# Altium schematic sheet RS485.SchDoc
size A4; SheetNumber: 7; SheetTotal: 8
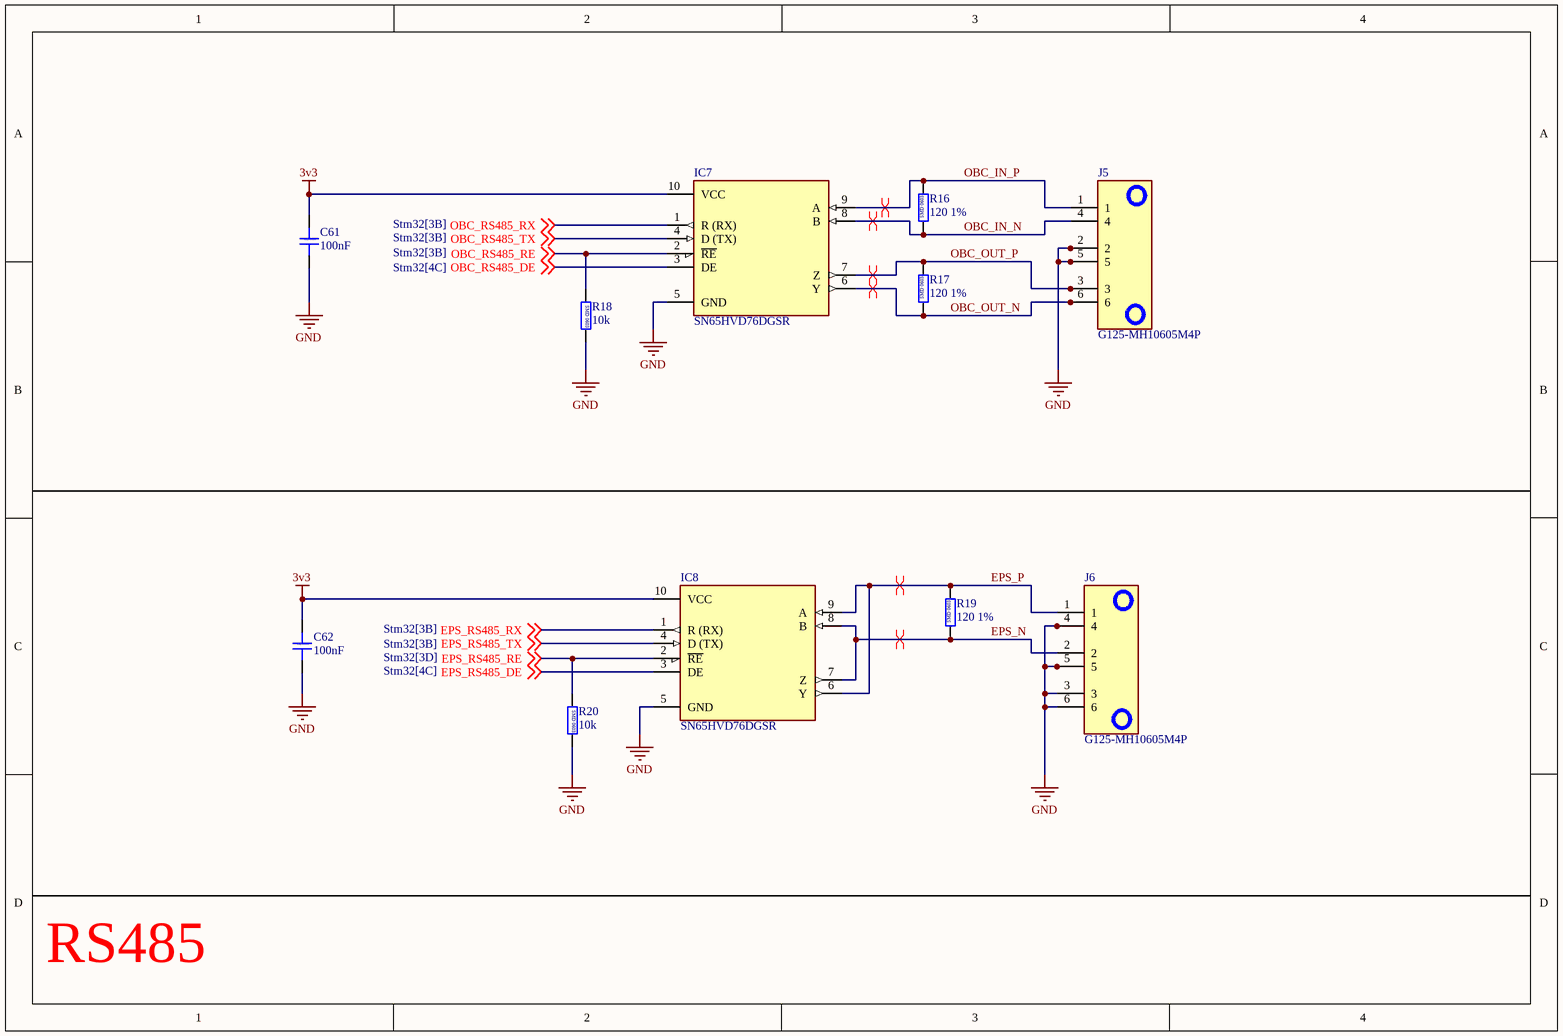
[diagram p0: RS485.SchDoc]

## Parts
C61  100nF  [CAP_0603]
C62  100nF  [CAP_0603]
IC7  SN65HVD76DGSR  [SOP50P490X110-10N]
IC8  SN65HVD76DGSR  [SOP50P490X110-10N]
J5  G125-MH10605M4P  [G125-MH10605M4P_1]
J6  G125-MH10605M4P  [G125-MH10605M4P_1]
R16  120 1%  [RES_0603]
R17  120 1%  [RES_0603]
R18  10k  [RES_0603]
R19  120 1%  [RES_0603]
R20  10k  [RES_0603]

## Nets
3v3: C61.1 C62.1 IC7.10(VCC) IC8.10(VCC)
GND: C61.2 C62.2 IC7.5(GND) IC8.5(GND) J5.2 J5.5 J6.3 J6.4 J6.5 J6.6 R18.2 R20.2
EPS_N: IC8.7(Z) IC8.8(B) J6.2 R19.1
EPS_P: IC8.6(Y) IC8.9(A) J6.1 R19.2
EPS_RS485_DE: IC8.3(DE) ; off-sheet EPS_RS485_DE
EPS_RS485_RE: IC8.2(~{RE}) R20.1 ; off-sheet EPS_RS485_RE
EPS_RS485_RX: IC8.1(R_(RX)) ; off-sheet EPS_RS485_RX
EPS_RS485_TX: IC8.4(D_(TX)) ; off-sheet EPS_RS485_TX
OBC_IN_N: IC7.8(B) J5.4 R16.1
OBC_IN_P: IC7.9(A) J5.1 R16.2
OBC_OUT_N: IC7.6(Y) J5.6 R17.1
OBC_OUT_P: IC7.7(Z) J5.3 R17.2
OBC_RS485_DE: IC7.3(DE) ; off-sheet OBC_RS485_DE
OBC_RS485_RE: IC7.2(~{RE}) R18.1 ; off-sheet OBC_RS485_RE
OBC_RS485_RX: IC7.1(R_(RX)) ; off-sheet OBC_RS485_RX
OBC_RS485_TX: IC7.4(D_(TX)) ; off-sheet OBC_RS485_TX

## Layout directives
differential pair: EPS_N, EPS_P, OBC_IN_N, OBC_IN_P, OBC_OUT_N, OBC_OUT_P

## Notes on the sheet
- RS485
- (in symbol Capacitor-SMD-0603) SMD 0603
- (in symbol Resistor-SMD-0603) SMD 0603

## Library data of the parts
C61 C62 = Capacitor-SMD-0603: Capacitor SMD 0603 RATED
IC7 IC8 = SN65HVD76DGSR: RS485 Full Duplex Transciever; Manufacturer_Name: Texas Instruments; Datasheet Link: http://www.ti.com/lit/gpn/sn65hvd76; Height: 1.1mm; Manufacturer_Part_Number: SN65HVD76DGSR; Mouser Part Number: 595-SN65HVD76DGSR; Mouser Price/Stock: https://www.mouser.co.uk/ProductDetail/Texas-Instruments/SN65HVD76DGSR?qs=7z%252BmIopC6%2FI%252B8LLIzcebYw%3D%3D; Arrow Part Number: SN65HVD76DGSR; Arrow Price/Stock: https://www.arrow.com/en/products/sn65hvd76dgsr/texas-instruments?region=nac
J5 J6 = G125-MH10605M4P: Connector; Manufacturer_Name: Harwin; Datasheet Link: https://content.harwin.com/m/667f1be9427fb768/original/DRG-02921-Technical-Drawing-Datasheet-G125-MH1XX05M4P-pdf.pdf; Height: 5.3mm; Manufacturer_Part_Number: G125-MH10605M4P; Mouser Part Number: 855-G125MH1065M4PM4P; Mouser Price/Stock: https://www.mouser.co.uk/ProductDetail/Harwin/G125-MH10605M4P?qs=vHuUswq2%252BswF07IXFR1W6A%3D%3D
R16-R20 = Resistor-SMD-0603: Resistor SMD 0603 RATED